# EAGLE design LNA copy (EAGLE 8.6.0)
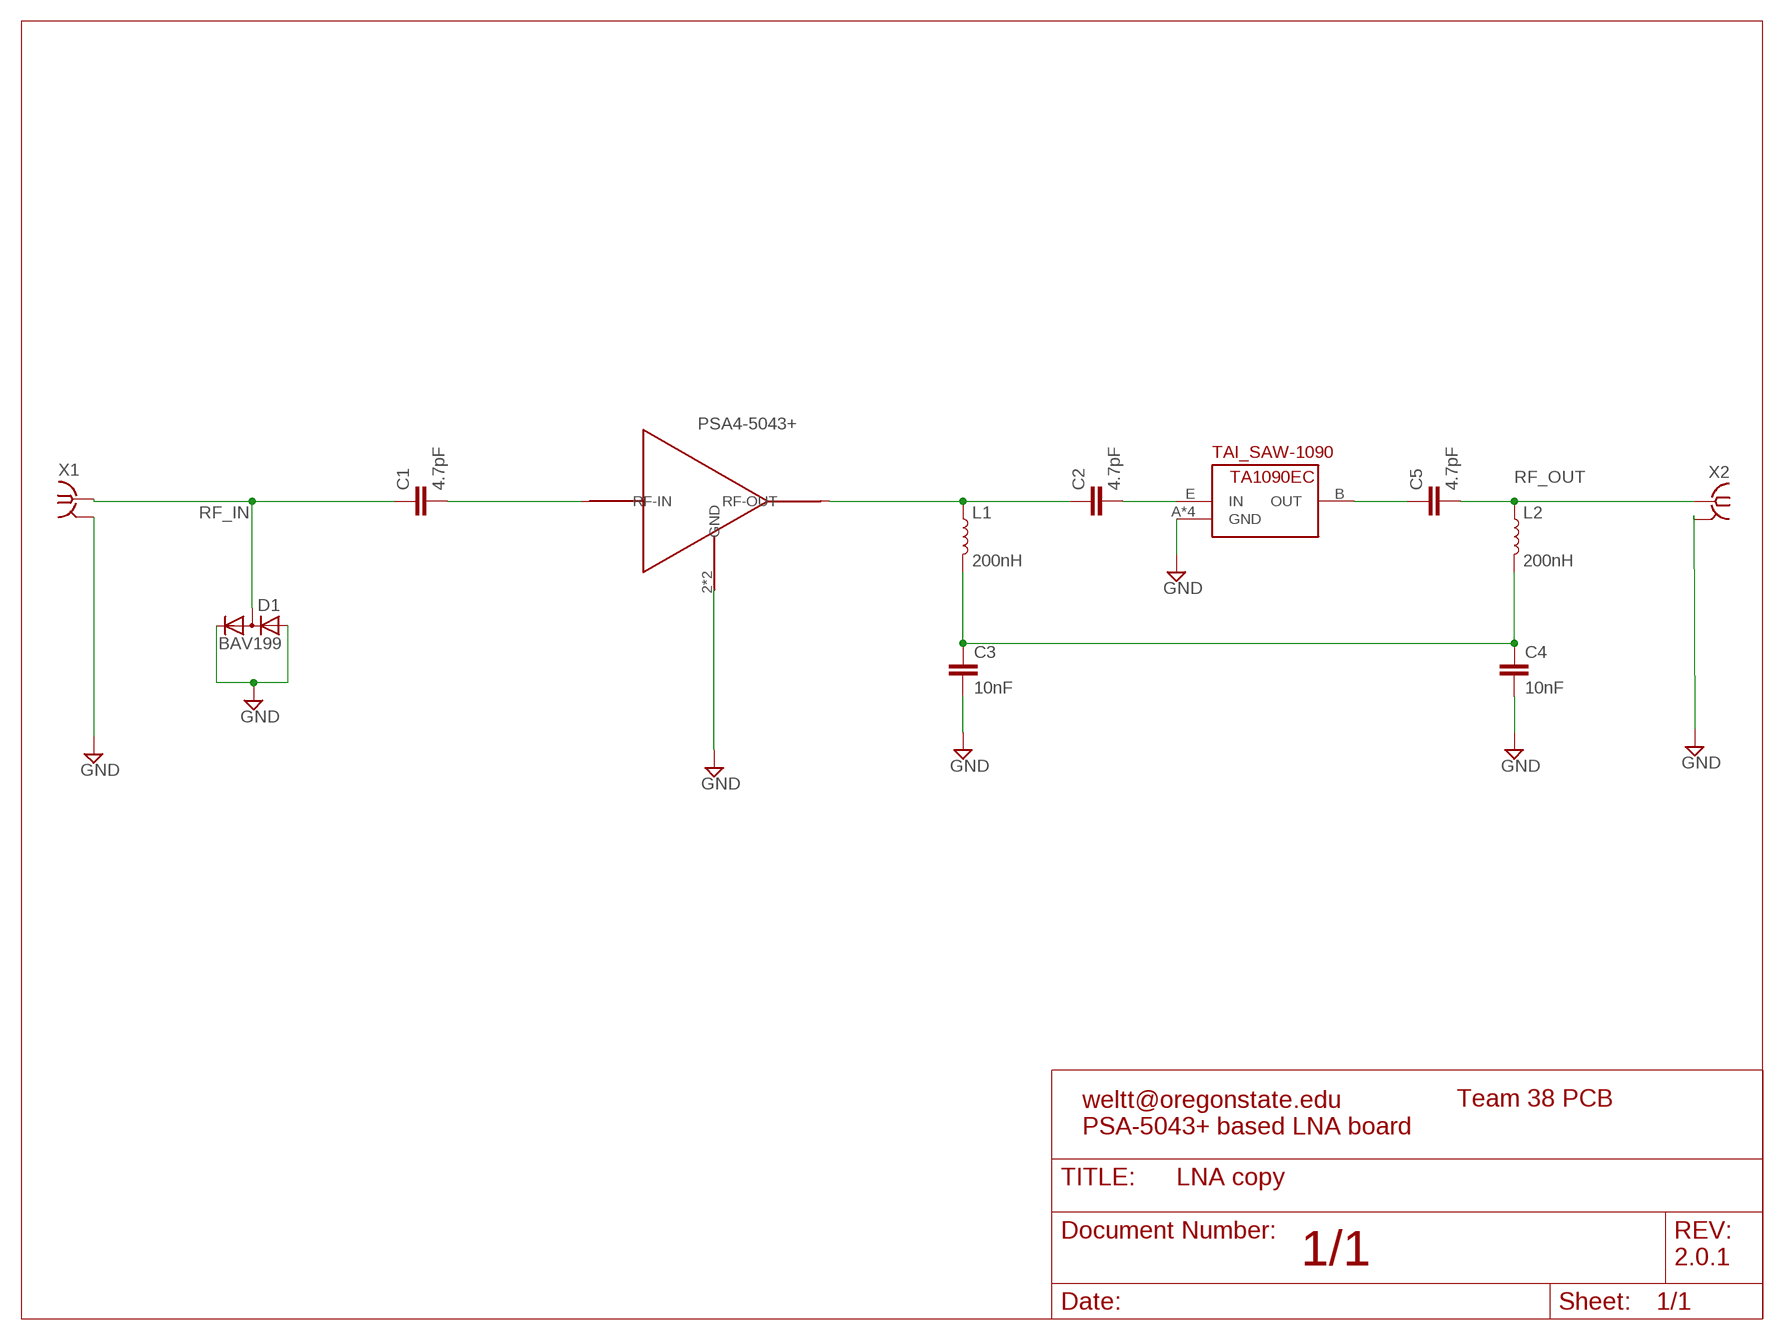
[diagram p0: schematic, sheet 1]

## Parts
C1  4.7pF  C-EUC0402  [C0402]
C2  4.7pF  C-EUC0402  [C0402]
C3  10nF  C-EUC0402  [C0402]
C4  10nF  C-EUC0402  [C0402]
C5  4.7pF  C-EUC0402  [C0402]
D1  BAV199  [SOT23]
L1  200nH  INDUCTOR-0603-33NH  [0603]
L2  200nH  INDUCTOR-0603-33NH  [0603]
PSA$-5043  PSA4-5043+  [PSA4-5043+]
U$1  TA1090EC  [TA1090EC]
X1  SMA-142-0701-801/806  [J502-ND-142-0701-801/806]
X2  SMA-142-0701-801/806  [J502-ND-142-0701-801/806]

## Nets
BIAS_TEE: C3.1 C4.1 L1.2 L2.2
FIN: C2.2 U$1.E(IN)
GND: C3.2 C4.2 D1.1(A) D1.2(C) PSA$-5043.2(GND) PSA$-5043.4(GND) U$1.A(GND) U$1.C(GND) U$1.D(GND) U$1.F(GND) X1.G@1 X1.G@2 X1.G@3 X1.G@4 X2.G@1 X2.G@2 X2.G@3 X2.G@4
LNA_OUT: C2.1 L1.1 PSA$-5043.1(RF-OUT)
N$1: C1.2 PSA$-5043.3(RF-IN)
N$5: C5.1 U$1.B(OUT)
RF_IN: C1.1 D1.3(AC) X1.1
RF_OUT: C5.2 L2.1 X2.1

## Notes on the sheet
- Team 38 PCB
- weltt@oregonstate.edu
  PSA-5043+ based LNA board
- 1/1 | 2.0.1

## Library data of the parts
C1-C5 = rcl:C-EU: CAPACITOR, European symbol; SPICEPREFIX: C
D1 = diode:BAV199: DIODE low-leakage double diode
L1 L2 = SparkFun-Coils:INDUCTOR: Inductors Resist changes in electrical current. Basically a coil of wire. SparkFun Products: SparkFun Load Cell Amplifier - HX711 <https://www.sparkfun.com/products/13879> IOIO-OTG - V2.2 <https://www.sparkfun.com/products/13613>; PROD_ID: NDUC-07874; VALUE: 33nH/±5%/500mA
PSA$-5043 = PSA4-5043_:PSA4-5043+; AVAILABILITY: Unavailable; DESCRIPTION: Ultra Low Noise MMIC Amplifier, 50ohm, 0.05 to 4 GHz; MF: Mini-Circuits; MP: PSA4-5043+; PACKAGE: MMM1362; PRICE: 2.50; SPICEPREFIX: M
U$1 = ta1090ec:TA1090EC
X1 X2 = con-coax:SMA-: SMA 50 Ohm End Launch Jack Receptacle - Round Contact Johnson Components Source: www.johnsoncomponents.com .. J502-ND.pdf; MF: JOHNSON COMPONENTS; MPN: 142-0701-801; OC_FARNELL: 1608592; OC_NEWARK: 90F2624

## Board
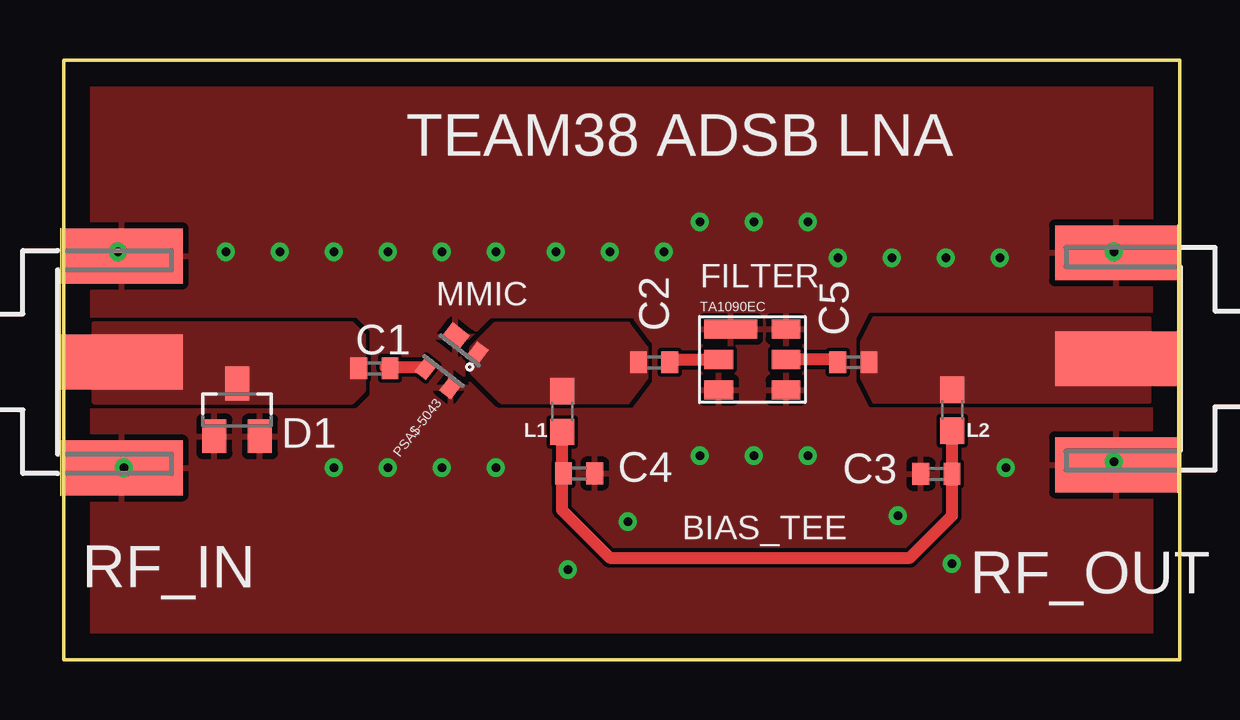
[diagram p1: board, top side]
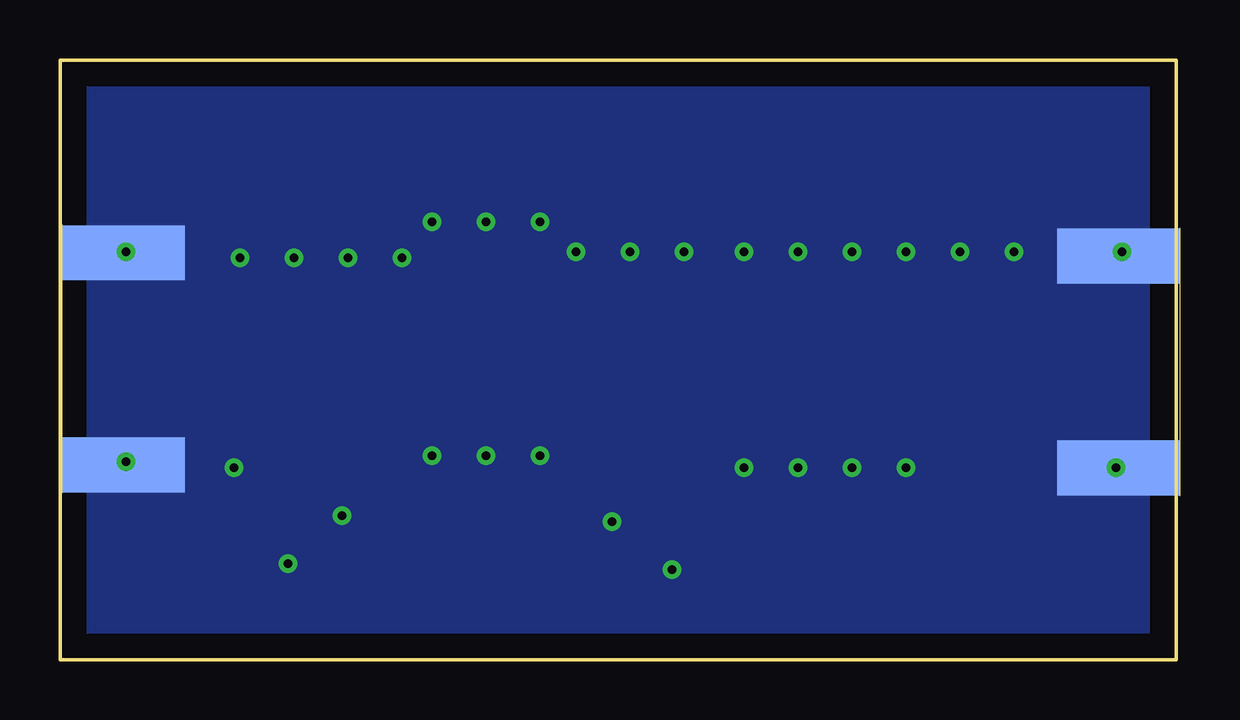
[diagram p2: board, bottom side, seen from below]

Size 46.5 x 25 mm. Coordinates in mm from the lower left corner, seen from the top.
Outline: 0,0 0,25 46.5,25 46.5,0 0,0
Copper layers (1*16): Top 0.035mm / dielectric 1.5mm / Bottom 0.035mm
Design rules "default": minimum track width 6mil, minimum drill 0.35mm, track to track 6mil, track to pad 6mil, pad to pad 6mil, via to via 6mil, smd to smd 6mil, copper to edge 40mil, drill to drill 6mil, minimum pad ring 10mil, minimum via ring 8mil, stop-mask expansion 4mil, vias tented up to drill 0mil, thermal gap 10mil

### Footprints (pad centres in the part's own frame; a part is rotated, then mirrored left to right if it is on the bottom)
C0402 = smd 0.7 x 0.9: 1 -0.65,0; 2 0.65,0
SOT23 = smd 1 x 1.4: 1 -0.95,-1.1; 2 0.95,-1.1; 3 0,1.1
0603 = smd 1.1 x 1: 1 -0.85,0; 2 0.85,0
PSA4-5043+ = smd 0.6 x 0.8: 1 -0.65,-0.9; 3 0.65,0.9; 4 -0.65,0.9 | smd 0.9 x 0.8: 2 0.5,-0.9
TA1090EC = smd 1.2 x 0.8: A 1.4,1.27; B 1.4,0; C 1.4,-1.27; D -1.4,-1.27; E -1.4,0 | smd 2.2 x 0.8: F -0.9,1.27
J502-ND-142-0701-801/806 = smd 5.08 x 2.286: 1 2.565,0; G@1 2.565,4.42; G@2 2.565,-4.42 | smd 5.08 x 2.286 bottom: G@3 2.565,4.42; G@4 2.565,-4.42

### Placement (x,y rotation side)
C1  12.94,12.14 0 top
C2  24.59,12.39 0 top
C3  36.36,7.74 180 top
C4  21.47,7.76 0 top
C5  32.9,12.4 0 top
D1  7.22,10.41 0 top
L1  20.76,10.34 270 top
L2  37.01,10.4 270 top
PSA$-5043  16.16,12.46 142.1 top
U$1  28.69,12.51 0 top
X1  -0.16,12.41 0 top
X2  46.41,12.54 180 top

### Tracks (layer width: path | path; a pad name or v marks a point on that pad's centre or on a via)
BIAS_TEE
  Top 0.508: 20.75,7.83 20.75,6.25 22.75,4.25 35.25,4.25 37,6 C3.1 | 21,9.75 20.75,9.75 | 20.75,9.75 20.75,7.83 | C4.1 20.75,7.83 | L1.2 20.76,9.74 20.75,9.75 | C3.1 | L2.2 C3.1
FIN
  Top 0.152: 25.3,12.5 C2.2 | 27.28,12.5 U$1.E
  Top 0.508: 27.28,12.5 25.3,12.5
GND  (via drill 0.35)
  Top 0.152: 27.43,11.28 U$1.D 27.28,11.12 | 30.02,11.28 U$1.C 30.18,11.12 | 30.02,13.87 U$1.A 30.18,13.87 | 2.74,16.76 X1.G@3 | 16.31,13.56 PSA$-5043.2 | 27.89,13.87 28.8,13.87 U$1.F 27.89,13.87
  other vias: 26.5,8.5 28.75,8.5 31,8.5 39,16.75 32.25,16.75 34.5,16.75 36.75,16.75 26.5,18.25 28.75,18.25 31,18.25 20.5,17 22.75,17 25,17 13.5,17 15.75,17 18,17 11.25,17 9,17 6.75,17 2.5,8 21,3.75 18,8 15.75,8 13.5,8 11.25,8 34.75,6 23.5,5.75 39.25,8 37,4 2.25,17 43.75,8.25 43.75,17
  pour Bottom (no thermals): 0,25 0,0 46.5,0 46.5,25
  pour Top (rank 6): 0,25 0,0 46.5,0 46.5,25
LNA_OUT
  pour Top (no thermals): 24.25,11.75 23.5,10.75 18.25,10.75 17,12 17,13 18,14 23.5,14 24.25,13
N$1
  Top 0.152: 15.09,12.19 PSA$-5043.3 | 13.41,12.19 C1.2
  Top 0.508: 13.41,12.19 15.09,12.19
N$5
  Top 0.508: 30.18,12.5 30.1,12.5 U$1.B 32.14,12.51 C5.1
RF_IN
  Top 0.152: 2.74,12.34 X1.1
  pour Top (no thermals): 1.25,14 1.25,10.75 12,10.75 12.5,11.25 12.5,13.5 12,14
RF_OUT
  Top 0.152: 33.38,12.34 C5.2
  pour Top (no thermals): 33.25,11.75 33.75,10.75 45.25,10.75 45.25,14.25 33.75,14.25 33.25,13.25

### Text on the board
tNames: TEAM38 ADSB LNA | FILTER | MMIC | BIAS_TEE | RF_IN | RF_OUT